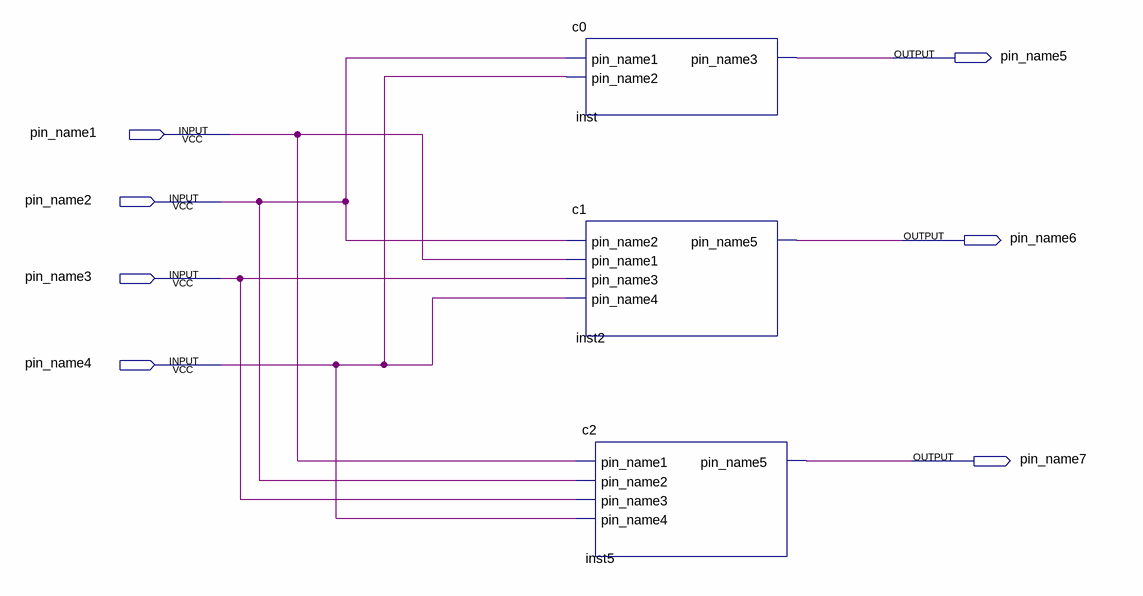
[diagram p0: schematic sheet]
// Quartus schematic adder.bdf as structural Verilog: 3 symbols, 7 pins
module adder (
  input  pin_name1,
  input  pin_name2,
  input  pin_name3,
  input  pin_name4,
  output pin_name5,
  output pin_name6,
  output pin_name7
);

  c0 inst (.pin_name1(pin_name2), .pin_name2(pin_name4), .pin_name3(pin_name5));
  c1 inst2 (
    .pin_name2(pin_name2), .pin_name1(pin_name1), .pin_name3(pin_name3), .pin_name4(pin_name4),
    .pin_name5(pin_name6));
  c2 inst5 (
    .pin_name1(pin_name1), .pin_name2(pin_name2), .pin_name3(pin_name3), .pin_name4(pin_name4),
    .pin_name5(pin_name7));
endmodule
